# Altium schematic sheet Power.SchDoc: Title
size Tabloid; Revision: A; ProjectTitle: CDU: CAN Display Unit
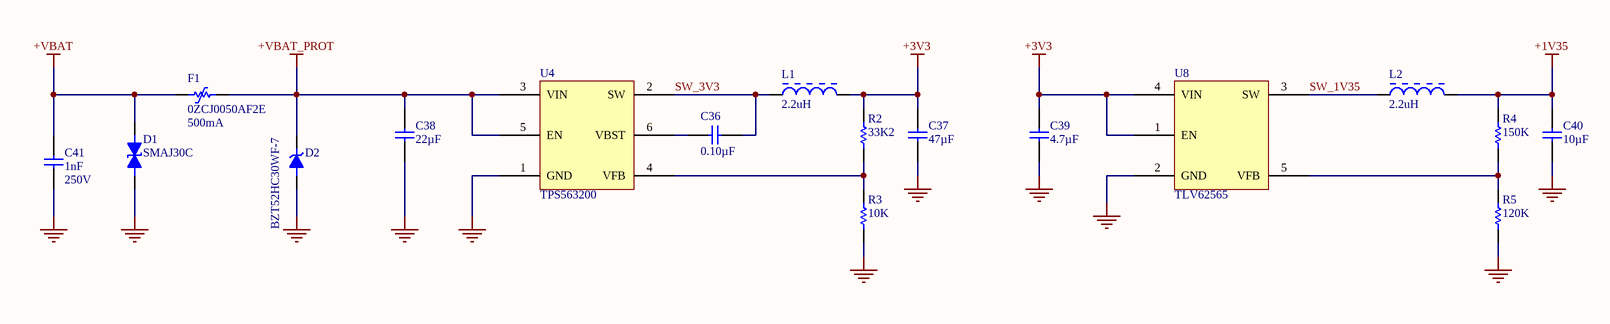
[diagram p0: Power.SchDoc]

## Parts
C36  value 0.10µF  [CAP-0402-M]  (hidden comment: CAP 0.10µF ±10% 25V 0402 X7R)
C37  value 47µF  [CAP-1210-M]  (hidden comment: CAP 47µF ±20% 6.3V 1210 X5R)
C38  value 22µF  [CAP-1210-M]  (hidden comment: CAP 22µF ±10% 25V 1210 X5R)
C39  value 4.7µF  [CAP-0805-M]  (hidden comment: CAP 4.7µF ±10% 6.3V 0805 X5R)
C40  value 10µF  [CAP-0805-M]  (hidden comment: CAP 10µF ±10% 6.3V 0805 X5R)
C41  value 1nF  Voltage: 250V  [CAP-0805-M]  (hidden comment: CAP 1nF ±10% 250V 0805 X7R)
D1  SMAJ30C  [SON127P500X135-2N]
D2  BZT52HC30WF-7  [SODFL340X115-2N]
F1  0ZCJ0050AF2E  value 500mA  [0ZCJ-1206-0.9]
L1  value 2.2uH  [INDP8080X40N]  (hidden comment: SRN8040-2R2Y)
L2  value 2.2uH  [INDP4848X28N]  (hidden comment: SRR4028-2R2Y)
R2  value 33K2  [RES-0603-M]  (hidden comment: RES 33K2 1% 1/10 W 0603 ±100ppm/°C)
R3  value 10K  [RES-0603-M]  (hidden comment: RES 10K 1% 1/10 W 0603 ±100ppm/°C)
R4  value 150K  [RES-0603-M]  (hidden comment: RES 150K 1% 1/10 W 0603 ±100ppm/°C)
R5  value 120K  [RES-0603-M]  (hidden comment: RES 120K 1% 1/10 W 0603 ±100ppm/°C)
U4  TPS563200  [TSOP95P280X110-6N]
U8  TLV62565  [SOT95P280X145-5N]

## Nets
+1V35: C40.2 L2.2 R4.2
+3V3: C37.2 C39.2 L1.2 R2.2 U8.1(EN) U8.4(VIN)
+VBAT: C41.1 D1.1 F1.1
+VBAT_PROT: C38.2 D2.1(K) F1.2 U4.3(VIN) U4.5(EN)
GND: C37.1 C38.1 C39.1 C40.1 C41.2 D1.2 D2.2(A) R3.1 R5.1 U4.1(GND) U8.2(GND)
SW_1V35: L2.1 U8.3(SW)
SW_3V3: C36.2 L1.1 U4.2(SW)
NetC36_1: C36.1 U4.6(VBST)
NetR2_1: R2.1 R3.2 U4.4(VFB)
NetR4_1: R4.1 R5.2 U8.5(VFB)

## Notes on the sheet
- Date:
- Revision:
- Sheet:
- /

## Library data of the parts
C36 = CC0402KRX7R8BB104: Manufacturer: Yageo; Manufacturer Series: CC; Part Number: CC0402KRX7R8BB104; Component Type: Standard; Tolerance: ±10%; Voltage: 25V; Package: 0402; Temperature Coefficient: X7R; Temperature Range: -55°C ~ 125°C; Supplier 1: Digi-Key; Supplier Part Number 1: 311-2077-1-ND
C37 = CC1210MKX5R5BB476: Manufacturer: Yageo; Manufacturer Series: CC; Part Number: CC1210MKX5R5BB476; Component Type: Standard; Tolerance: ±20%; Voltage: 6.3V; Package: 1210; Temperature Coefficient: X5R; Temperature Range: -55°C ~ 85°C; Supplier 1: Digi-Key; Supplier Part Number 1: 311-2047-1-ND
C38 = CC1210KKX5R8BB226: Manufacturer: Yageo; Manufacturer Series: CC; Part Number: CC1210KKX5R8BB226; Component Type: Standard; Tolerance: ±10%; Voltage: 25V; Package: 1210; Temperature Coefficient: X5R; Temperature Range: -55°C ~ 85°C; Supplier 1: Digi-Key; Supplier Part Number 1: 311-2021-1-ND
C39 = CC0805KKX5R5BB475: Manufacturer: Yageo; Manufacturer Series: CC; Part Number: CC0805KKX5R5BB475; Component Type: Standard; Tolerance: ±10%; Voltage: 6.3V; Package: 0805; Temperature Coefficient: X5R; Temperature Range: -55°C ~ 85°C; Supplier 1: Digi-Key; Supplier Part Number 1: 311-1861-1-ND
C40 = CC0805KKX5R5BB106: Manufacturer: Yageo; Manufacturer Series: CC; Part Number: CC0805KKX5R5BB106; Component Type: Standard; Tolerance: ±10%; Voltage: 6.3V; Package: 0805; Temperature Coefficient: X5R; Temperature Range: -55°C ~ 85°C; Supplier 1: Digi-Key; Supplier Part Number 1: 311-1459-1-ND
C41 = CC0805KRX7RYBB102: Manufacturer: Yageo; Manufacturer Series: CC; Part Number: CC0805KRX7RYBB102; Component Type: Standard; Tolerance: ±10%; Package: 0805; Temperature Coefficient: X7R; Temperature Range: -55°C ~ 125°C; Supplier 1: Digi-Key; Supplier Part Number 1: 311-1470-1-ND
R2 = RC0603FR-0733K2L: Manufacturer: Yageo; Manufacturer Series: RC; Power: 1/10 W; Part Number: RC0603FR-0733K2L; Component Type: Standard; Tolerance: 1%; Package: 0603; Temperature Coefficient: ±100ppm/°C; Temperature Range: -55°C ~ 155°C; Supplier 1: Digi-Key; Supplier Part Number 1: 311-33.2KHRCT-ND
R3 = RC0603FR-0710KL: Manufacturer: Yageo; Manufacturer Series: RC; Power: 1/10 W; Part Number: RC0603FR-0710KL; Component Type: Standard; Tolerance: 1%; Package: 0603; Temperature Coefficient: ±100ppm/°C; Temperature Range: -55°C ~ 155°C; Supplier 1: Digi-Key; Supplier Part Number 1: 311-10.0KHRCT-ND
R4 = RC0603FR-07150KL: Manufacturer: Yageo; Manufacturer Series: RC; Power: 1/10 W; Part Number: RC0603FR-07150KL; Component Type: Standard; Tolerance: 1%; Package: 0603; Temperature Coefficient: ±100ppm/°C; Temperature Range: -55°C ~ 155°C; Supplier 1: Digi-Key; Supplier Part Number 1: 311-150KHRCT-ND
R5 = RC0603FR-07120KL: Manufacturer: Yageo; Manufacturer Series: RC; Power: 1/10 W; Part Number: RC0603FR-07120KL; Component Type: Standard; Tolerance: 1%; Package: 0603; Temperature Coefficient: ±100ppm/°C; Temperature Range: -55°C ~ 155°C; Supplier 1: Digi-Key; Supplier Part Number 1: 311-120KHRCT-ND
U4 = TPS563200: 4.5-V To 17-V Input, 2-A, 3-A Synchronous Step-Down Voltage Regulator In  6 Pin SOT-23
U8 = TLV62565: x 1.5-A High Efficiency Step-Down Converters in SOT-23 5-Pin Package
D2 = BZT52HC30WF-7: Supplier 1: Digi-Key; Supplier Part Number 1: BZT52HC30WF-7DICT-ND